# EAGLE schematic meter (EAGLE 6.2)
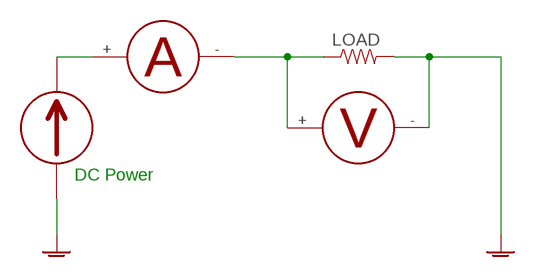
[diagram p0: schematic, sheet 1]

## Parts
DC_POEWR  DCPOWER  [PS12]
LOAD  RESISTORPTH-1/4W  [AXIAL-0.4]
U$1  AMMETER  [METER]
U$2  VOLTMETER  [METER]

## Nets
AGND: DC_POEWR.P$1(VGND) LOAD.P$2 U$2.-
N$1: DC_POEWR.P$2(VOUT) U$1.+
N$2: LOAD.P$1 U$1.- U$2.+

## Notes on the sheet
- DC Power

## Library data of the parts
DC_POEWR = My Library:DCPOWER
LOAD = My Library:RESISTOR: Resistor Basic schematic elements and footprints for 0603, 1206, and PTH resistors.
U$1 = My Library:AMMETER
U$2 = My Library:VOLTMETER